# EAGLE board Avalon16 (EAGLE 5.12)
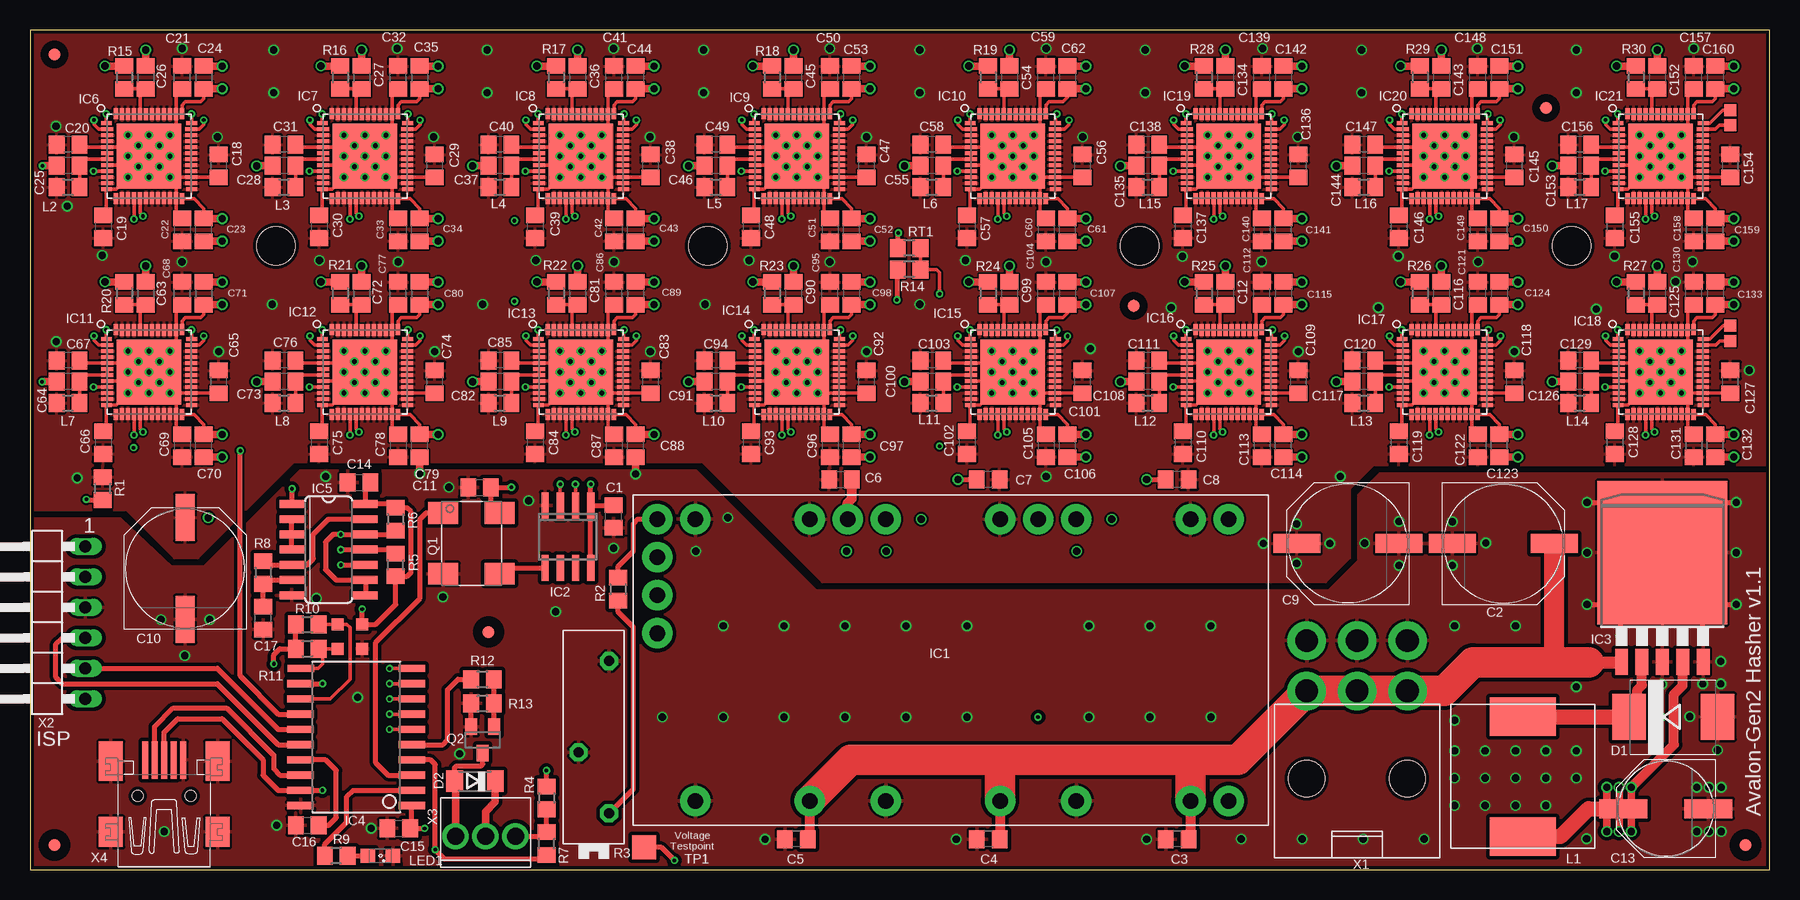
[diagram p5: board, top side]
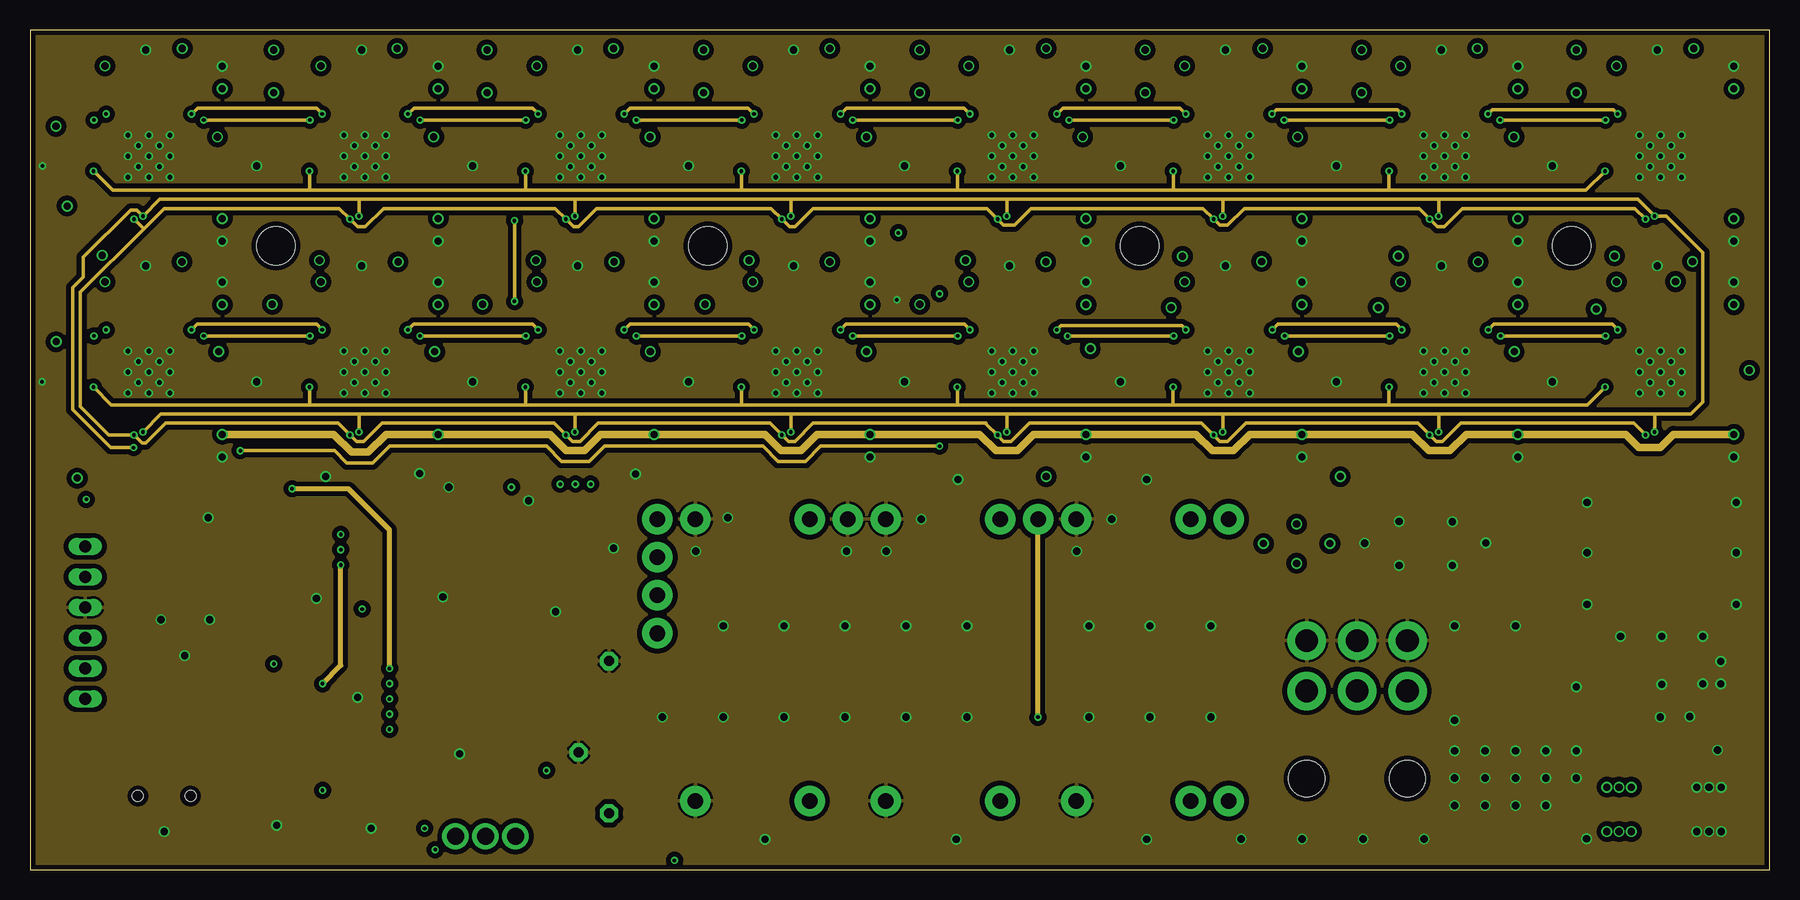
[diagram p6: board, inner layer Route2]
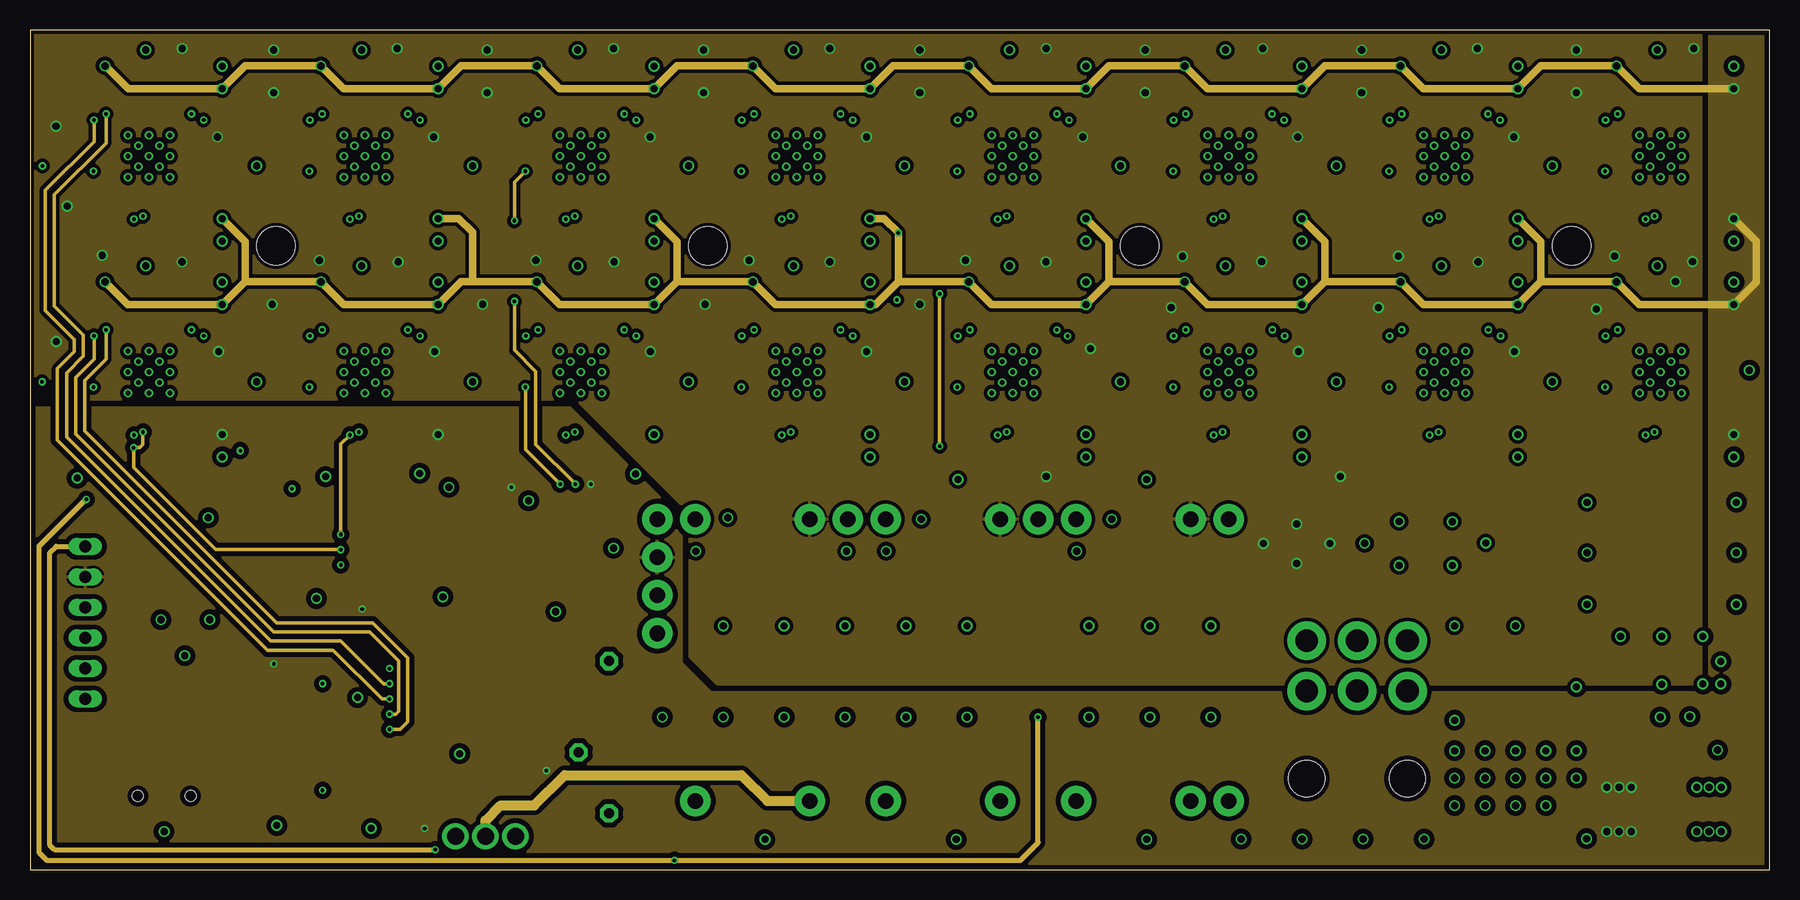
[diagram p7: board, inner layer Route15]
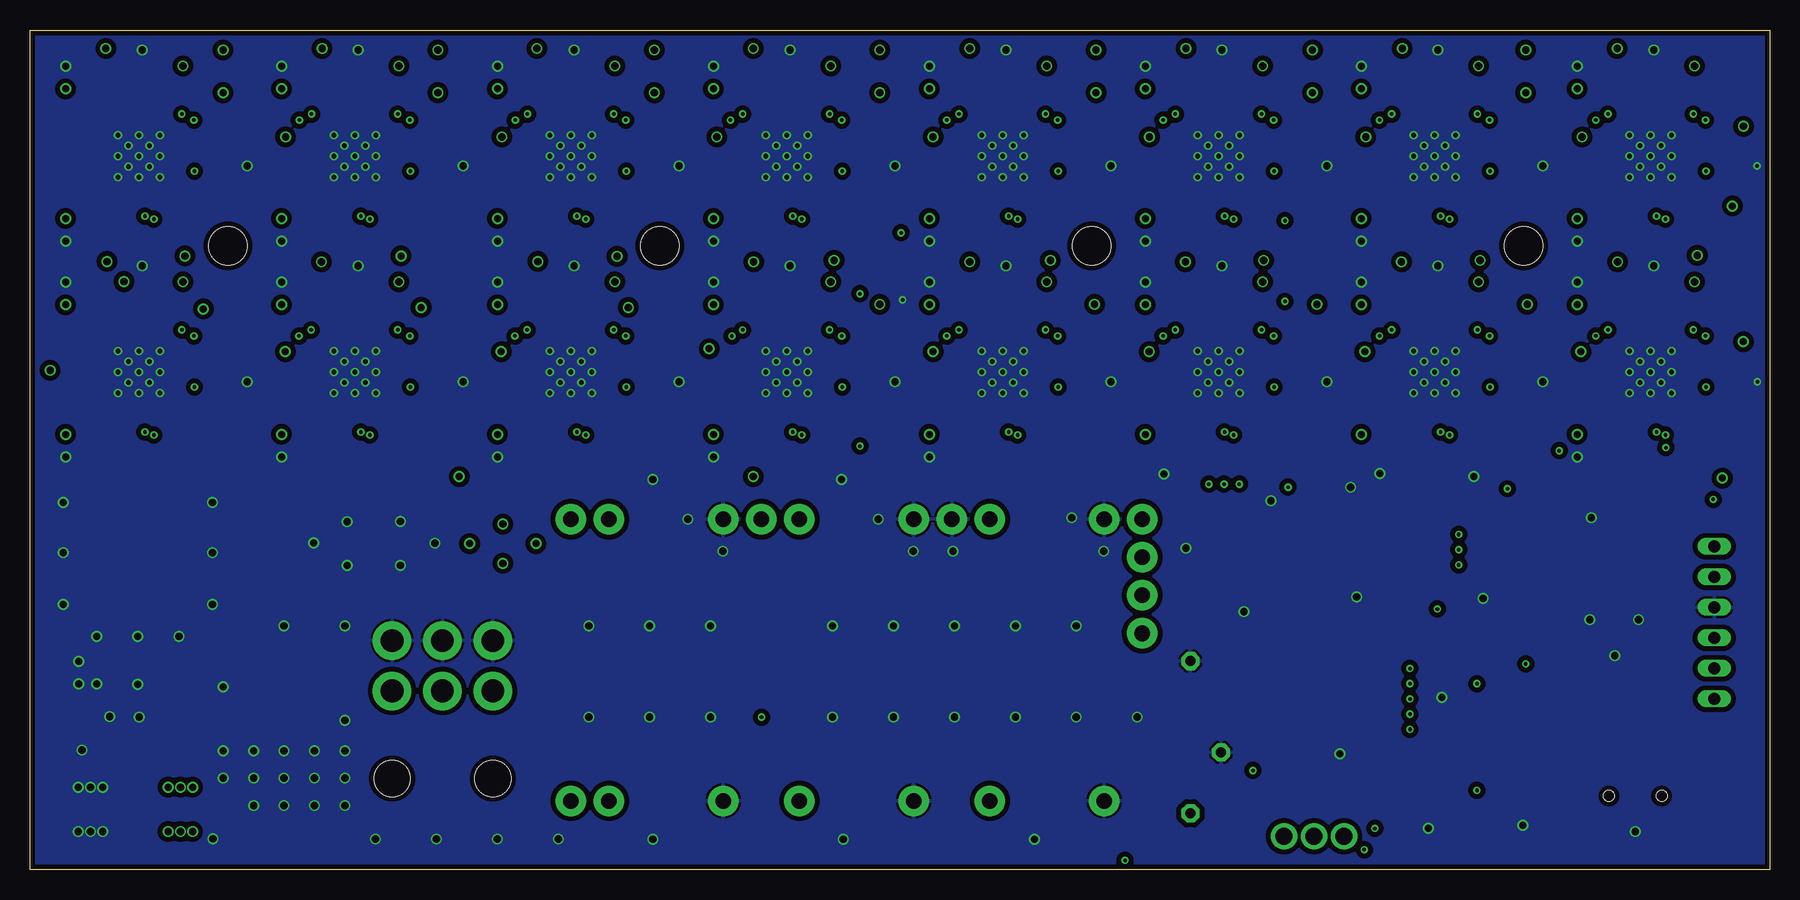
[diagram p8: board, bottom side, seen from below]

Size 145 x 70 mm. Coordinates in mm from the lower left corner, seen from the top.
Outline: 0,0 145,0 145,70 0,70 0,0
Copper layers (1+2*15+16): Top 0.035mm / dielectric 0.38mm / Route2 0.035mm / dielectric 0.71mm / Route15 0.035mm / dielectric 0.38mm / Bottom 0.035mm
Design rules "PCB-POOL Standard_ML4 *": minimum track width 0.15mm, minimum drill 0.3mm, track to track 0.15mm, track to pad 0.15mm, pad to pad 0.15mm, via to via 0.15mm, smd to smd 0.15mm, copper to edge 0.3mm, drill to drill 0.2mm, minimum pad ring 0.2mm, minimum via ring 0.15mm, stop-mask expansion 0.075mm, vias tented up to drill 0mil, thermal gap 0.2mm
Holes 3.2 mm at 20.5,52 56.5,52 128.5,52 92.5,52

## Footprints (pad centres in the part's own frame; a part is rotated, then mirrored left to right if it is on the bottom)
C0805 = smd 1.3 x 1.5: 1 -0.95,0; 2 0.95,0
PANASONIC_G = smd 3.9 x 1.6: + 4.25,0; - -4.25,0
PANASONIC_F = smd 4 x 1.6: + 3.55,0; - -3.55,0
SMC = smd 2.8 x 3.8: A 3.7,0; C -3.7,0
SOD80C = smd 1.4 x 1.8: A 1.7,0; C -1.7,0
FIDUCIAL = smd 1 x 1: 1 0,0
PTH12040WAH = drill 1.3 pad 2.54 round: 1 -20.213,-12.377; 2 -10.688,-12.377; 3 -4.338,-12.377; 4 5.187,-12.377; 5 11.537,-12.377; 6 21.062,-12.377; 7 24.237,-12.377; 8 24.237,11.118; 9 21.062,11.118; 10 11.537,11.118; 11 8.362,11.118; 12 5.187,11.118; 13 -4.338,11.118; 14 -7.513,11.118; 15 -10.688,11.118; 16 -20.213,11.118; 17 -23.388,11.118; 18 -23.388,7.943; 19 -23.388,4.768; 20 -23.388,1.593
SO8 = smd 0.6 x 2.2: 1 -1.905,-2.6; 2 -0.635,-2.6; 3 0.635,-2.6; 4 1.905,-2.6; 5 1.905,2.6; 6 0.635,2.6; 7 -0.635,2.6; 8 -1.905,2.6
TO263-5 = smd 1.067 x 2.159: 1 -3.404,-5.791; 2 -1.702,-5.791; 3 0,-5.791; 4 1.702,-5.791; 5 3.404,-5.791 | smd 10.8 x 11.938: 6 0,3.302
SOIC20 = smd 0.61 x 2.21: 1 -5.715,-4.636; 2 -4.445,-4.636; 3 -3.175,-4.636; 4 -1.905,-4.636; 5 -0.635,-4.636; 6 0.635,-4.636; 7 1.905,-4.636; 8 3.175,-4.636; 9 4.445,-4.636; 10 5.715,-4.636; 11 5.715,4.61; 12 4.445,4.636; 13 3.175,4.636; 14 1.905,4.636; 15 0.635,4.636; 16 -0.635,4.636; 17 -1.905,4.636; 18 -3.175,4.636; 19 -4.445,4.636; 20 -5.715,4.636
SO14 = smd 0.66 x 2.032: 1 -3.81,-3.073; 2 -2.54,-3.073; 3 -1.27,-3.073; 4 0,-3.073; 5 1.27,-3.073; 6 2.54,-3.073; 7 3.81,-3.073; 8 3.81,3.073; 9 2.54,3.073; 10 1.27,3.073; 11 0,3.073; 12 -1.27,3.073; 13 -2.54,3.073; 14 -3.81,3.073
QFN48 = smd 0.9 x 0.35: 1 -3.55,2.75; 12 -3.55,-2.75; 25 3.55,-2.75; 36 3.55,2.75 | smd 1 x 0.35: 2 -3.5,2.25; 3 -3.5,1.75; 4 -3.5,1.25; 5 -3.5,0.75; 6 -3.5,0.25; 7 -3.5,-0.25; 8 -3.5,-0.75; 9 -3.5,-1.25; 10 -3.5,-1.75; 11 -3.5,-2.25; 26 3.5,-2.25; 27 3.5,-1.75; 28 3.5,-1.25; 29 3.5,-0.75; 30 3.5,-0.25; 31 3.5,0.25; 32 3.5,0.75; 33 3.5,1.25; 34 3.5,1.75; 35 3.5,2.25 | smd 0.35 x 0.9: 13 -2.75,-3.55; 24 2.75,-3.55; 37 2.75,3.55; 48 -2.75,3.55 | smd 0.35 x 1: 14 -2.25,-3.5; 15 -1.75,-3.5; 16 -1.25,-3.5; 17 -0.75,-3.5; 18 -0.25,-3.5; 19 0.25,-3.5; 20 0.75,-3.5; 21 1.25,-3.5; 22 1.75,-3.5; 23 2.25,-3.5; 38 2.25,3.5; 39 1.75,3.5; 40 1.25,3.5; 41 0.75,3.5; 42 0.25,3.5; 43 -0.25,3.5; 44 -0.75,3.5; 45 -1.25,3.5; 46 -1.75,3.5; 47 -2.25,3.5 | smd 5.4 x 5.4: EXP 0,0
WUERTH-7447709101 = smd 5.5 x 3.2: 1 0,-5; 2 0,5
L0805 = smd 1.3 x 1.5: 1 -0.95,0; 2 0.95,0
SML0805 = smd 1.2 x 1.2: A 1.05,0; C -1.05,0
7W = smd 1.8 x 2.5: 1 -2.54,-2.35; 2 2.54,-2.35; 3 2.54,2.35; 4 -2.54,2.35
SOT23 = smd 1 x 1.4: 1 -0.95,-1.1; 2 0.95,-1.1; 3 0,1.1
R0805 = smd 1.3 x 1.5: 1 -0.95,0; 2 0.95,0
PT-SPIN = drill 0.813 pad 1.524 octagon: 1 -6.35,-1.27; 2 6.35,-1.27; 3 -1.27,1.27
0805 = smd 1.3 x 1.5: 1 -0.95,0; 2 0.95,0
TP20SQ = smd 2 x 2: TP 0,0
TP10SQ = smd 1 x 1: TP 0,0
MOLEX-45558-0003 = drill 1.9 pad 3.2 round: 1 4.2,7.3; 2 0,7.3; 3 -4.2,7.3; 4 4.2,11.5; 5 0,11.5; 6 -4.2,11.5 | hole 3: -4.2,0; 4.2,0
1X06/270 = drill 1.016 long: 1 -6.35,0; 2 -3.81,0; 3 -1.27,0; 4 1.27,0; 5 3.81,0; 6 6.35,0
MOLEX-22-04-1031 = drill 1.4 pad 2.2 round: 1 2.5,3.2; 2 0,3.2; 3 -2.5,3.2
32005-301 = smd 3.1 x 0.5: 1 3,1.6; 2 3,0.8; 3 3,0; 4 3,-0.8; 5 3,-1.6 | smd 2.5 x 2: M1 -3,-4.45; M2 -3,4.45 | smd 3.3 x 2: M3 2.9,4.45; M4 2.9,-4.45 | hole 0.9: 0,2.2; 0,-2.2

## Placement (x,y rotation side)
C1  100n  [C0805]  48.65,29.43 90 top
C2  680µ/16V/EEEFK1C681P  [PANASONIC_G]  122.81,27.18 0 top
C3  1µ  [C0805]  95.63,2.54 180 top
C4  1µ  [C0805]  79.88,2.54 180 top
C5  1µ  [C0805]  63.88,2.54 180 top
C6  10µ  [C0805]  67.56,32.51 0 top
C7  10µ  [C0805]  79.88,32.51 180 top
C8  10µ  [C0805]  95.63,32.51 180 top
C9  680µ/16V/EEEFK1C681P  [PANASONIC_G]  109.86,27.18 180 top
C10  680µ/16V/EEEFK1C681P  [PANASONIC_G]  12.94,25.1 90 top
C11  100n  [C0805]  37.48,31.86 0 top
C12  1µ  [C0805]  99.65,48.04 270 top
C13  1000µ/6.3V/EEEFP0J102AP  [PANASONIC_F]  136.36,5.07 180 top
C14  100n  [C0805]  27.43,32.26 0 top
C15  100n  [C0805]  30.73,3.43 0 top
C16  100n  [C0805]  23.11,3.68 0 top
C17  470p  [C0805]  19.43,20.95 90 top
C18  1µ  [C0805]  15.75,58.67 90 top
C19  1µ  [C0805]  6.1,53.59 270 top
C20  1µ  [C0805]  3.17,60.45 180 top
C21  1µ  [C0805]  12.7,66.04 90 top
C22  1µ  [C0805]  12.7,53.34 270 top
C23  1µ  [C0805]  14.48,53.34 90 top
C24  1µ  [C0805]  14.48,66.04 270 top
C25  1µ  [C0805]  3.17,58.67 180 top
C26  1µ  [C0805]  9.65,66.04 270 top
C27  1µ  [C0805]  27.65,66.04 270 top
C28  1µ  [C0805]  21.18,58.67 180 top
C29  1µ  [C0805]  33.75,58.67 90 top
C30  1µ  [C0805]  24.1,53.59 270 top
C31  1µ  [C0805]  21.18,60.45 180 top
C32  1µ  [C0805]  30.7,66.04 90 top
C33  1µ  [C0805]  30.7,53.34 270 top
C34  1µ  [C0805]  32.48,53.34 90 top
C35  1µ  [C0805]  32.48,66.04 270 top
C36  1µ  [C0805]  45.65,66.04 270 top
C37  1µ  [C0805]  39.17,58.67 180 top
C38  1µ  [C0805]  51.75,58.67 90 top
C39  1µ  [C0805]  42.1,53.59 270 top
C40  1µ  [C0805]  39.17,60.45 180 top
C41  1µ  [C0805]  48.7,66.04 90 top
C42  1µ  [C0805]  48.7,53.34 270 top
C43  1µ  [C0805]  50.48,53.34 90 top
C44  1µ  [C0805]  50.48,66.04 270 top
C45  1µ  [C0805]  63.65,66.04 270 top
C46  1µ  [C0805]  57.17,58.67 180 top
C47  1µ  [C0805]  69.75,58.67 90 top
C48  1µ  [C0805]  60.1,53.59 270 top
C49  1µ  [C0805]  57.17,60.45 180 top
C50  1µ  [C0805]  66.7,66.04 90 top
C51  1µ  [C0805]  66.7,53.34 270 top
C52  1µ  [C0805]  68.48,53.34 90 top
C53  1µ  [C0805]  68.48,66.04 270 top
C54  1µ  [C0805]  81.65,66.04 270 top
C55  1µ  [C0805]  75.17,58.67 180 top
C56  1µ  [C0805]  87.75,58.67 90 top
C57  1µ  [C0805]  78.1,53.59 270 top
C58  1µ  [C0805]  75.17,60.45 180 top
C59  1µ  [C0805]  84.7,66.04 90 top
C60  1µ  [C0805]  84.7,53.34 270 top
C61  1µ  [C0805]  86.48,53.34 90 top
C62  1µ  [C0805]  86.48,66.04 270 top
C63  1µ  [C0805]  9.65,48.04 270 top
C64  1µ  [C0805]  3.17,40.67 180 top
C65  1µ  [C0805]  15.75,40.67 90 top
C66  1µ  [C0805]  6.1,35.59 270 top
C67  1µ  [C0805]  3.17,42.45 180 top
C68  1µ  [C0805]  12.7,48.04 90 top
C69  1µ  [C0805]  12.7,35.34 270 top
C70  1µ  [C0805]  14.48,35.34 90 top
C71  1µ  [C0805]  14.48,48.04 270 top
C72  1µ  [C0805]  27.65,48.04 270 top
C73  1µ  [C0805]  21.18,40.67 180 top
C74  1µ  [C0805]  33.75,40.67 90 top
C75  1µ  [C0805]  24.1,35.59 270 top
C76  1µ  [C0805]  21.18,42.45 180 top
C77  1µ  [C0805]  30.7,48.04 90 top
C78  1µ  [C0805]  30.7,35.34 270 top
C79  1µ  [C0805]  32.48,35.34 90 top
C80  1µ  [C0805]  32.48,48.04 270 top
C81  1µ  [C0805]  45.65,48.04 270 top
C82  1µ  [C0805]  39.17,40.67 180 top
C83  1µ  [C0805]  51.75,40.67 90 top
C84  1µ  [C0805]  42.1,35.59 270 top
C85  1µ  [C0805]  39.17,42.45 180 top
C86  1µ  [C0805]  48.7,48.04 90 top
C87  1µ  [C0805]  48.7,35.34 270 top
C88  1µ  [C0805]  50.48,35.34 90 top
C89  1µ  [C0805]  50.48,48.04 270 top
C90  1µ  [C0805]  63.65,48.04 270 top
C91  1µ  [C0805]  57.17,40.67 180 top
C92  1µ  [C0805]  69.75,40.67 90 top
C93  1µ  [C0805]  60.1,35.59 270 top
C94  1µ  [C0805]  57.17,42.45 180 top
C95  1µ  [C0805]  66.7,48.04 90 top
C96  1µ  [C0805]  66.7,35.34 270 top
C97  1µ  [C0805]  68.48,35.34 90 top
C98  1µ  [C0805]  68.48,48.04 270 top
C99  1µ  [C0805]  81.65,48.04 270 top
C100  1µ  [C0805]  75.17,40.67 180 top
C101  1µ  [C0805]  87.75,40.67 90 top
C102  1µ  [C0805]  78.1,35.59 270 top
C103  1µ  [C0805]  75.17,42.45 180 top
C104  1µ  [C0805]  84.7,48.04 90 top
C105  1µ  [C0805]  84.7,35.34 270 top
C106  1µ  [C0805]  86.48,35.34 90 top
C107  1µ  [C0805]  86.48,48.04 270 top
C108  1µ  [C0805]  93.17,40.67 180 top
C109  1µ  [C0805]  105.75,40.67 90 top
C110  1µ  [C0805]  96.1,35.59 270 top
C111  1µ  [C0805]  93.17,42.45 180 top
C112  1µ  [C0805]  102.7,48.04 90 top
C113  1µ  [C0805]  102.7,35.34 270 top
C114  1µ  [C0805]  104.48,35.34 90 top
C115  1µ  [C0805]  104.48,48.04 270 top
C116  1µ  [C0805]  117.65,48.04 270 top
C117  1µ  [C0805]  111.17,40.67 180 top
C118  1µ  [C0805]  123.75,40.67 90 top
C119  1µ  [C0805]  114.1,35.59 270 top
C120  1µ  [C0805]  111.17,42.45 180 top
C121  1µ  [C0805]  120.7,48.04 90 top
C122  1µ  [C0805]  120.7,35.34 270 top
C123  1µ  [C0805]  122.48,35.34 90 top
C124  1µ  [C0805]  122.48,48.04 270 top
C125  1µ  [C0805]  135.65,48.04 270 top
C126  1µ  [C0805]  129.18,40.67 180 top
C127  1µ  [C0805]  141.75,40.67 90 top
C128  1µ  [C0805]  132.1,35.59 270 top
C129  1µ  [C0805]  129.18,42.45 180 top
C130  1µ  [C0805]  138.7,48.04 90 top
C131  1µ  [C0805]  138.7,35.34 270 top
C132  1µ  [C0805]  140.48,35.34 90 top
C133  1µ  [C0805]  140.48,48.04 270 top
C134  1µ  [C0805]  99.65,66.04 270 top
C135  1µ  [C0805]  93.17,58.67 180 top
C136  1µ  [C0805]  105.75,58.67 90 top
C137  1µ  [C0805]  96.1,53.59 270 top
C138  1µ  [C0805]  93.17,60.45 180 top
C139  1µ  [C0805]  102.7,66.04 90 top
C140  1µ  [C0805]  102.7,53.34 270 top
C141  1µ  [C0805]  104.48,53.34 90 top
C142  1µ  [C0805]  104.48,66.04 270 top
C143  1µ  [C0805]  117.65,66.04 270 top
C144  1µ  [C0805]  111.17,58.67 180 top
C145  1µ  [C0805]  123.75,58.67 90 top
C146  1µ  [C0805]  114.1,53.59 270 top
C147  1µ  [C0805]  111.17,60.45 180 top
C148  1µ  [C0805]  120.7,66.04 90 top
C149  1µ  [C0805]  120.7,53.34 270 top
C150  1µ  [C0805]  122.48,53.34 90 top
C151  1µ  [C0805]  122.48,66.04 270 top
C152  1µ  [C0805]  135.65,66.04 270 top
C153  1µ  [C0805]  129.18,58.67 180 top
C154  1µ  [C0805]  141.75,58.67 90 top
C155  1µ  [C0805]  132.1,53.59 270 top
C156  1µ  [C0805]  129.18,60.45 180 top
C157  1µ  [C0805]  138.7,66.04 90 top
C158  1µ  [C0805]  138.7,53.34 270 top
C159  1µ  [C0805]  140.48,53.34 90 top
C160  1µ  [C0805]  140.48,66.04 270 top
D1  MBRS340T3G  [SMC]  136.98,12.73 0 top
D2  4448  [SOD80C]  37.08,7.37 180 top
FID1  1mm  [FIDUCIAL]  2.03,2.03 0 top
FID2  1mm  [FIDUCIAL]  143,2.03 0 top
FID3  1mm  [FIDUCIAL]  126.36,63.5 0 top
FID4  1mm  [FIDUCIAL]  2.03,67.94 270 top
FID5  1mm  [FIDUCIAL]  92,47 0 top
FID6  1mm  [FIDUCIAL]  38.23,19.81 0 top
IC1  PTH12040WAH  [PTH12040WAH]  75.67,18.1 0 top
IC2  NB3L553DG  [SO8]  44.84,27.75 180 top
IC3  LM2576S-3.3  [TO263-5]  136.06,23.12 0 top
IC4  PIC16LF1459  [SOIC20]  27.18,11.05 90 top
IC5  74HC02D  [SO14]  24.89,26.67 270 top
IC6  A3255Q48  [QFN48]  9.92,59.48 0 top
IC7  A3255Q48  [QFN48]  27.92,59.48 0 top
IC8  A3255Q48  [QFN48]  45.92,59.48 0 top
IC9  A3255Q48  [QFN48]  63.92,59.48 0 top
IC10  A3255Q48  [QFN48]  81.92,59.48 0 top
IC11  A3255Q48  [QFN48]  9.92,41.48 0 top
IC12  A3255Q48  [QFN48]  27.92,41.48 0 top
IC13  A3255Q48  [QFN48]  45.92,41.48 0 top
IC14  A3255Q48  [QFN48]  63.92,41.48 0 top
IC15  A3255Q48  [QFN48]  81.92,41.48 0 top
IC16  A3255Q48  [QFN48]  99.92,41.48 0 top
IC17  A3255Q48  [QFN48]  117.92,41.48 0 top
IC18  A3255Q48  [QFN48]  135.92,41.48 0 top
IC19  A3255Q48  [QFN48]  99.92,59.48 0 top
IC20  A3255Q48  [QFN48]  117.92,59.48 0 top
IC21  A3255Q48  [QFN48]  135.92,59.48 0 top
L1  100µ / Würth 7447709101  [WUERTH-7447709101]  124.43,7.76 180 top
L2  100µ  [L0805]  3.17,56.9 0 top
L3  100µ  [L0805]  21.18,56.9 0 top
L4  100µ  [L0805]  39.17,56.9 0 top
L5  100µ  [L0805]  57.17,56.9 0 top
L6  100µ  [L0805]  75.17,56.9 0 top
L7  100µ  [L0805]  3.17,38.9 0 top
L8  100µ  [L0805]  21.18,38.9 0 top
L9  100µ  [L0805]  39.17,38.9 0 top
L10  100µ  [L0805]  57.17,38.9 0 top
L11  100µ  [L0805]  75.17,38.9 0 top
L12  100µ  [L0805]  93.17,38.9 0 top
L13  100µ  [L0805]  111.17,38.9 0 top
L14  100µ  [L0805]  129.18,38.9 0 top
L15  100µ  [L0805]  93.17,56.9 0 top
L16  100µ  [L0805]  111.17,56.9 0 top
L17  100µ  [L0805]  129.18,56.9 0 top
LED1  green  [SML0805]  29.21,1.14 180 top
Q1  7W-25-000MBB-T  [7W]  36.8,27.19 270 top
Q2  IRFML8244TRPBF  [SOT23]  37.73,10.81 180 top
R1  0R  [R0805]  6.05,31.77 90 top
R2  15k  [R0805]  49.02,23.37 270 top
R3  100k  [PT-SPIN]  46.99,11.04 90 top
R4  10k  [R0805]  43.05,5.97 270 top
R5  390  [R0805]  30.48,25.4 90 top
R6  390  [R0805]  30.48,29.21 270 top
R7  100  [R0805]  43.05,2.16 90 top
R8  100  [R0805]  19.43,24.77 270 top
R9  100  [R0805]  25.53,1.14 180 top
R10  10k  [R0805]  23.11,20.45 0 top
R11  10k  [R0805]  23.11,18.41 0 top
R12  100  [R0805]  37.72,15.88 0 top
R13  10k  [R0805]  37.72,13.84 180 top
R14  1k  [R0805]  73.28,50.04 180 top
R15  100k  [R0805]  7.87,66.04 270 top
R16  100k  [R0805]  25.87,66.04 270 top
R17  100k  [R0805]  43.87,66.04 270 top
R18  100k  [R0805]  61.87,66.04 270 top
R19  100k  [R0805]  79.87,66.04 270 top
R20  100k  [R0805]  7.87,48.04 270 top
R21  100k  [R0805]  25.87,48.04 270 top
R22  100k  [R0805]  43.87,48.04 270 top
R23  100k  [R0805]  61.87,48.04 270 top
R24  100k  [R0805]  79.87,48.04 270 top
R25  100k  [R0805]  97.87,48.04 270 top
R26  100k  [R0805]  115.87,48.04 270 top
R27  100k  [R0805]  133.87,48.04 270 top
R28  100k  [R0805]  97.87,66.04 270 top
R29  100k  [R0805]  115.87,66.04 270 top
R30  100k  [R0805]  133.87,66.04 270 top
RT1  2k2  [0805]  73.28,51.82 180 top
TP1  TPSQTP20SQ  [TP20SQ]  51.21,1.84 0 top
TP2  TPSQTP10SQ  [TP10SQ]  141.73,63.32 0 top
TP3  TPSQTP10SQ  [TP10SQ]  141.73,62.05 0 top
TP4  TPSQTP10SQ  [TP10SQ]  141.73,45.34 0 top
TP5  TPSQTP10SQ  [TP10SQ]  141.73,44.07 0 top
TP6  TPSQTP10SQ  [TP10SQ]  27.69,20.45 90 top
TP7  TPSQTP10SQ  [TP10SQ]  25.65,18.41 90 top
TP8  TPSQTP10SQ  [TP10SQ]  25.65,20.45 90 top
TP9  TPSQTP10SQ  [TP10SQ]  27.69,18.41 90 top
X1  Molex 45558-0003  [MOLEX-45558-0003]  110.62,7.59 0 top
X2  ISP  [1X06/270]  4.6,20.59 270 top
X3  Molex 22-04-1031  [MOLEX-22-04-1031]  37.97,5.97 180 top
X4  Würth 65100516121 / TE 1734035-2  [32005-301]  11.18,6.13 90 top

## Tracks (layer width: path | path; a pad name or v marks a point on that pad's centre or on a via)
!MCLR  (via drill 0.3)
  Top 0.406: IC4.4 33.4,9.14 33.78,8.76 v33.78,1.65 34.54,0.89 42.73,0.89 R7.1
  Route15 0.406: X2.1 2.17,26.94 1.65,26.42 1.65,2.03 2.03,1.65 v33.78,1.65
!RESET1
  Top 0.305: R15.2 C26.2 9.17,64.61 IC6.44
!RESET2
  Top 0.305: R16.2 C27.2 27.17,64.61 IC7.44
!RESET3
  Top 0.305: R17.2 C36.2 45.17,64.61 IC8.44
!RESET4
  Top 0.305: R18.2 C45.2 63.17,64.61 IC9.44
!RESET5
  Top 0.305: R19.2 C54.2 81.17,64.61 IC10.44
!RESET6
  Top 0.305: R20.2 C63.2 9.17,46.61 IC11.44
!RESET7
  Top 0.305: R21.2 C72.2 27.17,46.61 IC12.44
!RESET8
  Top 0.305: R22.2 C81.2 45.17,46.61 IC13.44
!RESET9
  Top 0.305: R23.2 C90.2 63.17,46.61 IC14.44
!RESET10
  Top 0.305: R24.2 C99.2 81.17,46.61 IC15.44
!RESET11
  Top 0.305: R25.2 C12.2 99.17,46.61 IC16.44
!RESET12
  Top 0.305: R26.2 C116.2 117.17,46.61 IC17.44
!RESET13
  Top 0.305: R27.2 C125.2 135.17,46.61 IC18.44
!RESET14
  Top 0.305: R28.2 C134.2 99.17,64.61 IC19.44
!RESET15
  Top 0.305: R29.2 C143.2 117.17,64.61 IC20.44
!RESET16
  Top 0.305: R30.2 C152.2 135.17,64.61 IC21.44
+3V3  (via drill 0.3, 0.6)
  Top 0.305: IC6.37 12.67,63.72 12.95,64.01 14.22,64.01 14.48,64.26 C24.2 | IC6.24 13.67,55.93 14.48,55.12 C23.2 | IC7.37 30.67,63.72 30.95,64.01 32.22,64.01 32.48,64.26 C35.2 | IC7.24 31.67,55.93 32.48,55.12 C34.2 | IC8.37 48.67,63.72 48.95,64.01 50.22,64.01 50.48,64.26 C44.2 | IC8.24 49.67,55.93 50.48,55.12 C43.2 | IC9.37 66.67,63.72 66.95,64.01 68.22,64.01 68.48,64.26 C53.2 | IC9.24 67.67,55.93 68.48,55.12 C52.2 | IC10.37 84.67,63.72 84.95,64.01 86.1,64.01 86.48,64.39 C62.2 | IC10.24 85.67,55.93 86.48,55.12 C61.2 | IC11.37 12.67,45.72 12.95,46.01 14.22,46.01 14.48,46.26 C71.2 | IC11.24 13.67,37.93 14.48,37.12 C70.2 | IC12.37 30.67,45.72 30.95,46.01 32.22,46.01 32.48,46.26 C80.2 | IC12.24 31.67,37.93 32.48,37.12 C79.2 | IC13.37 48.67,45.72 48.95,46.01 50.22,46.01 50.48,46.26 C89.2 | IC13.24 49.67,37.93 50.48,37.12 C88.2 | IC14.37 66.67,45.72 66.95,46.01 68.22,46.01 68.48,46.26 C98.2 | IC14.24 67.67,37.93 68.48,37.12 C97.2 | IC15.37 84.67,45.72 84.95,46.01 86.1,46.01 86.48,46.39 C107.2 | IC15.24 85.67,37.93 86.48,37.12 C106.2 | IC16.37 102.67,45.72 102.95,46.01 104.22,46.01 104.48,46.26 C115.2 | IC16.24 103.67,37.93 104.48,37.12 C114.2 | IC17.37 120.67,45.72 120.95,46.01 122.22,46.01 122.48,46.26 C124.2 | IC17.24 121.67,37.93 122.48,37.12 C123.2 | IC18.37 138.67,45.72 138.95,46.01 140.22,46.01 140.48,46.26 C133.2 | IC18.24 139.67,37.93 140.48,37.12 C132.2 | IC19.37 102.67,63.72 102.95,64.01 104.22,64.01 104.48,64.26 C142.2 | IC19.24 103.67,55.93 104.48,55.12 C141.2 | IC20.37 120.67,63.72 120.95,64.01 122.22,64.01 122.48,64.26 C151.2 | IC20.24 121.67,55.93 122.48,55.12 C150.2
  Top 0.305: IC21.37 138.67,63.72 138.95,64.01 140.22,64.01 140.48,64.26 C160.2 | IC21.24 139.67,55.93 140.48,55.12 C159.2
  Top 0.406: C14.2 27.96,31.84 IC5.14 30.16,30.48 R6.1 31.43,30.16 31.75,29.84 31.75,24.77 31.43,24.45 R5.1 30.48,22.1 28.83,20.45 TP6.TP v27.69,21.72 | IC2.8 IC2.1 | Q1.4 38.43,30.46 C11.2 40.12,31.86 v40.13,31.88 | IC2.1 48.61,30.35 C1.2 | IC2.1 v46.74,32.12 v46.74,32.13 | R4.1 v43.05,8.26 | v20.32,17.14 20.32,17.91 20.83,18.41 R11.1 R10.1 | 72.77,51.82 RT1.2 72.33,53.02 v72.39,53.09 | IC4.1 31.81,3.56 C15.2 v32.89,3.43
  Top 0.61: R15.1 6.26,66.99 v6.25,67 | C24.2 16.02,65.09 v16.03,65.1 | C23.2 16.02,54.29 v16.03,54.28 | R16.1 24.26,66.99 v24.25,67 | C35.2 34.02,65.09 v34.03,65.1 | C34.2 34.02,54.29 v34.03,54.28 | R17.1 42.26,66.99 v42.25,67 | C44.2 52.02,65.09 v52.03,65.1 | C43.2 52.02,54.29 v52.03,54.28 | R18.1 60.26,66.99 v60.25,67 | C53.2 70.02,65.09 v70.03,65.1 | C52.2 70.02,54.29 v70.03,54.28 | R19.1 78.26,66.99 v78.25,67 | C62.2 88.02,65.09 v88.03,65.1 | C61.2 88.02,54.29 v88.03,54.28 | R20.1 6.26,48.99 v6.25,49.01 | C71.2 16.02,47.09 v16.03,47.1 | C70.2 16.02,36.29 v16.03,36.28 | R21.1 24.26,48.99 v24.25,49.01 | C80.2 34.02,47.09 v34.03,47.1 | C79.2 34.02,36.29 v34.03,36.28 | R22.1 42.26,48.99 v42.25,49.01 | C89.2 52.02,47.09 v52.03,47.1 | C88.2 52.02,36.29 v52.03,36.28 | R23.1 60.26,48.99 v60.25,49.01 | C97.2 70.02,36.29 v70.03,36.28 | R24.1 78.26,48.99 v78.25,49.01 | C107.2 88.02,47.09 v88.03,47.1 | C106.2 88.02,36.29 v88.03,36.28 | v133.48,3.17 133.48,5.08 v133.48,6.86 | v131.44,3.17 v131.44,6.86 | v132.46,3.17 132.46,5.08 v132.46,6.86 | R25.1 96.26,48.99 v96.25,49.01 | C115.2 106.02,47.09 v106.03,47.1 | C114.2 106.02,36.29 v106.03,36.28 | R26.1 114.26,48.99 v114.25,49.01 | C124.2 124.02,47.09 v124.03,47.1 | C123.2 124.02,36.29 v124.03,36.28 | R27.1 132.26,48.99 v132.25,49.01 | C133.2 142.02,47.09 v142.03,47.1 | C132.2 142.02,36.29 v142.03,36.28 | R28.1 96.26,66.99 v96.25,67 | C142.2 106.02,65.09 v106.03,65.1 | C141.2 106.02,54.29 v106.03,54.28 | R29.1 114.26,66.99 v114.25,67 | C151.2 124.02,65.09 v124.03,65.1 | C150.2 124.02,54.29 v124.03,54.28 | R30.1 132.26,66.99 v132.25,67 | C160.2 142.02,65.09 v142.03,65.1 | C159.2 142.02,54.29 v142.03,54.28
  Top 0.61: C98.2 70.02,47.09 v70.03,47.1
  Top 0.813: 133.48,5.08 C13.+ | IC3.4 137.77,15.34 137.03,14.61 137.03,10.41 v133.48,6.86
  Top 1.27: 132.46,5.08 132.45,5.07 129.91,5.07 127.6,2.76 L1.2
  Route2 0.61: v16.03,36.28 25.32,36.28 26.8,34.8 28.19,34.8 29.68,36.28 v34.03,36.28 43.35,36.28 44.7,34.92 46.23,34.92 47.58,36.28 v52.03,36.28 61.26,36.28 62.61,34.92 64.26,34.92 65.62,36.28 v70.03,36.28 79.16,36.28 80.52,34.92 82.3,34.92 83.65,36.28 v88.03,36.28 97.2,36.28 98.55,34.92 100.33,34.92 101.69,36.28 v106.03,36.28 115.23,36.28 116.59,34.92 118.36,34.92 119.72,36.28 v124.03,36.28 133.01,36.28 134.11,35.18 135.89,35.18 136.99,36.28 v142.03,36.28
  Route15 0.406: 6.22,67.06 6.22,67.03 v6.25,67
  Route15 0.61: 53.93,49.01 v52.03,47.1 44.15,47.1 v42.25,49.01 36.88,49.01 | v52.03,54.28 53.93,52.38 53.93,49.01 | v16.03,54.28 17.93,52.38 17.93,49.01 | 17.93,49.01 v24.25,49.01 26.15,47.1 v34.03,47.1 35.93,49.01 36.88,49.01 | 53.93,49.01 v60.25,49.01 62.15,47.1 v70.03,47.1 v70.04,47.09 70.47,47.09 72.39,49.01 | 72.39,49.01 v78.25,49.01 80.15,47.1 v88.03,47.1 89.93,49.01 | v6.25,49.01 8.15,47.1 v16.03,47.1 17.93,49.01 | v34.03,54.28 35.74,54.28 36.88,53.14 36.88,49.01 | 6.22,67.06 8.18,65.1 v16.03,65.1 17.93,67 v24.25,67 26.15,65.1 v34.03,65.1 35.93,67 v42.25,67 44.15,65.1 v52.03,65.1 53.93,67 v60.25,67 62.15,65.1 v70.03,65.1 71.93,67 v78.25,67 80.15,65.1 v88.03,65.1 89.93,67 v96.25,67 98.15,65.1 v106.03,65.1 107.93,67 v114.25,67 116.15,65.1 v124.03,65.1 125.93,67 v132.25,67 134.15,65.1 v142.03,65.1 | 89.93,49.01 v96.25,49.01 98.15,47.1 v106.03,47.1 107.93,49.01 | v88.03,54.28 89.93,52.38 89.93,49.01 | v106.03,54.28 107.93,52.38 107.93,49.01 | 125.93,49.01 v132.25,49.01 134.15,47.1 v142.03,47.1 143.89,48.96 143.89,52.42 v142.03,54.28 | 125.93,49.01 v124.03,47.1 116.15,47.1 v114.25,49.01 107.93,49.01 | v124.03,54.28 125.93,52.38 125.93,49.01 | v70.03,54.28 71.2,54.28 v72.39,53.09 72.39,49.01
  pour Route15 (isolate 0.406): 145,0 145,70 140,70 140,14.75 56.75,14.75 54.25,17.25 54.25,29.25 45,38.5 0,38.5 0,0
+12V
  Top 0.61: X3.2 37.97,4.83 38.78,5.64 D2.C
  Top 0.813: IC1.2 64.99,2.7 C5.1 | IC1.4 80.86,2.57 C4.1 | IC1.6 96.74,2.7 C3.1
  Top 1.016: IC3.1 132.6,17.27 129.92,17.27 127.13,17.27 127.06,17.34
  Top 1.676: 127.06,17.34 C2.+
  Top 2.54: IC1.2 68.41,9.14 80.9,9.14 | 80.9,9.14 96.65,9.14 | 96.65,9.14 100.67,9.14 X1.3 X1.2 X1.1 117.89,14.89 120.27,17.27 129.92,17.27 | IC1.6 96.74,9.05 96.65,9.14 | IC1.4 80.86,9.11 80.9,9.14
  Route15 0.813: IC1.2 61.46,5.72 59.31,7.87 44.58,7.87 42.04,5.33 39.24,5.33 37.97,4.06 X3.2
CLK1  (via drill 0.3)
  Top 0.305: IC6.9 v5.29,58.23 | v23.29,58.23 IC7.9 | v41.29,58.23 IC8.9 | v59.29,58.23 IC9.9 | v77.29,58.23 IC10.9 | v95.29,58.23 IC19.9 | v131.29,58.23 IC21.9 | v113.29,58.23 IC20.9 | IC2.2 v45.47,32.12 v45.47,32.13
  Route2 0.305: 41.3,56.64 59.31,56.64 | 59.31,56.64 77.29,56.64 | v77.29,58.23 77.29,56.64 | v59.29,58.23 59.29,56.66 59.31,56.64 | v41.29,58.23 41.29,56.65 41.3,56.64 | 23.29,56.64 6.88,56.64 v5.29,58.23 | 23.29,56.64 41.3,56.64 | v23.29,58.23 23.29,56.64 | v131.29,58.23 129.71,56.64 113.28,56.64 | 95.25,56.64 113.28,56.64 | v113.29,58.23 v113.28,58.22 113.28,56.64 | v95.29,58.23 95.29,56.69 95.25,56.64 | 77.29,56.64 95.25,56.64 | v40.39,54.1 v40.39,47.37
  Route15 0.305: v45.47,32.13 42.16,35.43 42.16,41.53 40.39,43.31 v40.39,47.37 | v40.39,54.1 40.39,57.32 v41.29,58.23
CLK2  (via drill 0.3)
  Top 0.305: IC11.9 v5.29,40.23 | v23.29,40.23 IC12.9 | v41.29,40.23 IC13.9 | v59.29,40.23 IC14.9 | v77.29,40.23 IC15.9 | v95.29,40.23 IC16.9 | v113.29,40.23 IC17.9 | v131.29,40.23 IC18.9 | IC2.3 v44.2,32.12 v44.2,32.13
  Route2 0.305: 41.3,38.73 59.33,38.73 | 59.33,38.73 77.32,38.73 | v77.29,40.23 77.29,38.76 77.32,38.73 | v59.29,40.23 59.29,38.78 59.33,38.73 | v41.29,40.23 41.29,38.74 41.3,38.73 | 23.29,38.73 41.3,38.73 | v23.29,40.23 23.29,38.74 23.29,38.73 | 23.29,38.73 6.79,38.73 v5.29,40.23 | v131.29,40.23 129.8,38.73 113.28,38.73 | 95.25,38.73 113.28,38.73 | v113.29,40.23 v113.28,40.22 113.28,38.73 | v95.29,40.23 95.25,40.19 95.25,38.73 | 77.32,38.73 95.25,38.73
  Route15 0.305: v44.2,32.13 41.29,35.03 v41.29,40.23
CONFIG1_1_2_N  (via drill 0.3)
  Top 0.305: IC7.2 23.71,61.73 23.33,62.1 v23.33,62.48 | IC6.35 14.1,61.73 14.48,62.1 v14.48,62.48
  Route2 0.305: v14.48,62.48 v23.33,62.48
CONFIG1_1_2_P  (via drill 0.3)
  Top 0.305: IC7.1 24.37,62.97 v24.35,62.99 | IC6.36 v13.47,62.98 v13.46,62.99
  Route2 0.305: v13.46,62.99 13.97,63.5 23.88,63.5 24.35,63.03 v24.35,62.99
CONFIG1_2_3_N  (via drill 0.3)
  Top 0.305: IC8.2 41.71,61.73 41.33,62.1 v41.33,62.48 | IC7.35 32.14,61.73 32.51,62.1 v32.51,62.48
  Route2 0.305: v32.51,62.48 v41.33,62.48
CONFIG1_2_3_P  (via drill 0.3)
  Top 0.305: IC8.1 42.37,62.97 v42.35,62.99 | IC7.36 31.47,62.97 v31.5,62.99
  Route2 0.305: v31.5,62.99 32,63.5 41.91,63.5 42.35,63.06 v42.35,62.99
CONFIG1_3_4_N  (via drill 0.3)
  Top 0.305: IC9.2 59.71,61.73 59.33,62.1 v59.33,62.48 | IC8.35 50.17,61.73 50.55,62.1 v50.55,62.48
  Route2 0.305: v50.55,62.48 v59.33,62.48
CONFIG1_3_4_P  (via drill 0.3)
  Top 0.305: IC9.1 60.37,62.97 v60.35,62.99 | IC8.36 49.47,62.93 v49.53,62.99
  Route2 0.305: v49.53,62.99 50.04,63.5 59.84,63.5 v60.35,62.99
CONFIG1_4_5_N  (via drill 0.3)
  Top 0.305: IC10.2 77.71,61.73 77.33,62.1 v77.33,62.48 | IC9.35 68.2,61.73 68.58,62.1 v68.58,62.48
  Route2 0.305: v68.58,62.48 v77.33,62.48
CONFIG1_4_5_P  (via drill 0.3)
  Top 0.305: IC10.1 78.37,62.97 v78.35,62.99 | IC9.36 67.47,62.9 v67.56,62.99
  Route2 0.305: v67.56,62.99 68.07,63.5 77.84,63.5 v78.35,62.99
CONFIG1_5_6_N  (via drill 0.3)
  Top 0.305: IC19.2 95.71,61.73 95.33,62.1 v95.33,62.48 | IC10.35 86.24,61.73 86.61,62.1 v86.61,62.48
  Route2 0.305: v86.61,62.48 v95.33,62.48
CONFIG1_5_6_P  (via drill 0.3)
  Top 0.305: IC19.1 96.37,62.97 v96.35,62.99 | IC10.36 85.47,62.86 v85.6,62.99
  Route2 0.305: v85.6,62.99 86.11,63.5 95.84,63.5 v96.35,62.99
CONFIG1_6_7_N  (via drill 0.3)
  Top 0.305: IC19.35 104.17,61.73 104.55,62.1 v104.55,62.48 | IC20.2 113.71,61.73 113.33,62.1 v113.33,62.48
  Route2 0.305: v104.55,62.48 v113.33,62.48
CONFIG1_6_7_P  (via drill 0.3)
  Top 0.305: IC19.36 103.47,62.93 v103.53,62.99 | IC20.1 114.37,62.97 v114.35,62.99
  Route2 0.305: v103.53,62.99 103.91,63.37 113.97,63.37 v114.35,62.99
CONFIG1_7_8_N  (via drill 0.3)
  Top 0.305: IC20.35 122.17,61.73 122.55,62.1 v122.55,62.48 | IC21.2 131.71,61.73 131.33,62.1 v131.33,62.48
  Route2 0.305: v122.55,62.48 v131.33,62.48
CONFIG1_7_8_P  (via drill 0.3)
  Top 0.305: IC20.36 121.47,62.93 v121.53,62.99 | IC21.1 132.37,62.97 v132.35,62.99
  Route2 0.305: v121.53,62.99 121.91,63.37 131.97,63.37 v132.35,62.99
CONFIG1_8_N
  Top 0.305: IC21.35 140.49,61.73 140.82,62.05 TP3.TP
CONFIG1_8_P
  Top 0.305: IC21.36 140.03,62.23 141.12,63.32 TP2.TP
CONFIG1_N  (via drill 0.3)
  Top 0.305: IC6.2 5.71,61.73 5.33,62.1 v5.33,62.48 | v29.97,14.22 IC4.8
  Route15 0.305: v29.97,14.22 29.34,14.22 25.27,18.29 19.81,18.29 2.29,35.81 2.29,41.78 3.68,43.18 3.68,44.2 1.27,46.61 1.27,56.64 5.33,60.71 v5.33,62.48
CONFIG1_P  (via drill 0.3)
  Top 0.305: v29.97,15.49 IC4.9 | IC6.1 6.37,62.97 v6.35,62.99
  Route15 0.305: v29.97,15.49 29.46,15.49 25.91,19.05 20.07,19.05 3.05,36.07 3.05,41.4 4.45,42.8 4.45,44.58 2.03,46.99 2.03,56.26 6.35,60.58 v6.35,62.99
CONFIG2_1_2_N  (via drill 0.3)
  Top 0.305: IC12.2 23.71,43.73 23.33,44.1 v23.33,44.48 | IC11.35 14.1,43.73 14.48,44.1 v14.48,44.48
  Route2 0.305: v14.48,44.48 v23.33,44.48
CONFIG2_1_2_P  (via drill 0.3)
  Top 0.305: IC12.1 24.37,44.97 v24.35,44.99 | IC11.36 v13.47,44.98 v13.46,44.99
  Route2 0.305: v13.46,44.99 13.94,45.47 23.88,45.47 v24.35,44.99
CONFIG2_2_3_N  (via drill 0.3)
  Top 0.305: IC13.2 41.71,43.73 41.33,44.1 v41.33,44.48 | IC12.35 32.14,43.73 32.51,44.1 v32.51,44.48
  Route2 0.305: v32.51,44.48 v41.33,44.48
CONFIG2_2_3_P  (via drill 0.3)
  Top 0.305: IC13.1 42.37,44.97 v42.35,44.99 | IC12.36 31.47,44.97 v31.5,44.99
  Route2 0.305: v31.5,44.99 31.97,45.47 41.88,45.47 v42.35,44.99
CONFIG2_3_4_N  (via drill 0.3)
  Top 0.305: IC14.2 59.71,43.73 59.33,44.1 v59.33,44.48 | IC13.35 50.17,43.73 50.55,44.1 v50.55,44.48
  Route2 0.305: v50.55,44.48 v59.33,44.48
CONFIG2_3_4_P  (via drill 0.3)
  Top 0.305: IC14.1 60.37,44.97 v60.35,44.99 | IC13.36 49.47,44.93 v49.53,44.99
  Route2 0.305: v49.53,44.99 50,45.47 59.88,45.47 v60.35,44.99
CONFIG2_4_5_N  (via drill 0.3)
  Top 0.305: IC15.2 77.71,43.73 77.33,44.1 v77.33,44.48 | IC14.35 68.2,43.73 68.58,44.1 v68.58,44.48
  Route2 0.305: v68.58,44.48 v77.33,44.48
CONFIG2_4_5_P  (via drill 0.3)
  Top 0.305: IC15.1 78.37,44.97 v78.35,44.99 | IC14.36 67.47,44.9 v67.56,44.99
  Route2 0.305: v67.56,44.99 68.04,45.47 77.88,45.47 v78.35,44.99
CONFIG2_5_6_N  (via drill 0.3)
  Top 0.305: IC16.2 95.71,43.73 95.33,44.1 v95.33,44.48 | IC15.35 86.15,43.73 86.49,44.07 v86.49,44.48
  Route2 0.305: v86.49,44.48 v95.33,44.48
CONFIG2_5_6_P  (via drill 0.3)
  Top 0.305: IC16.1 96.37,44.97 v96.35,44.99 | IC15.36 85.47,44.85 v85.6,44.98
  Route2 0.305: v85.6,44.98 85.95,45.34 96,45.34 v96.35,44.99
CONFIG2_6_7_N  (via drill 0.3)
  Top 0.305: IC16.35 104.2,43.73 104.58,44.1 v104.58,44.48 | IC17.2 113.71,43.73 113.33,44.1 v113.33,44.48
  Route2 0.305: v104.58,44.48 v113.33,44.48
CONFIG2_6_7_P  (via drill 0.3)
  Top 0.305: IC16.36 103.47,44.9 v103.56,44.99 | IC17.1 114.37,44.97 v114.35,44.99
  Route2 0.305: v103.56,44.99 104.04,45.47 113.88,45.47 v114.35,44.99
CONFIG2_7_8_N  (via drill 0.3)
  Top 0.305: IC17.35 122.2,43.73 122.58,44.1 v122.58,44.48 | IC18.2 131.71,43.73 131.33,44.1 v131.33,44.48
  Route2 0.305: v122.58,44.48 v131.33,44.48
CONFIG2_7_8_P  (via drill 0.3)
  Top 0.305: IC17.36 121.47,44.9 v121.56,44.99 | IC18.1 132.37,44.97 v132.35,44.99
  Route2 0.305: v121.56,44.99 122.04,45.47 131.88,45.47 v132.35,44.99
CONFIG2_8_N
  Top 0.305: IC18.35 140.5,43.73 140.84,44.07 TP5.TP
CONFIG2_8_P
  Top 0.305: IC18.36 140.04,44.23 141.15,45.34 TP4.TP
CONFIG2_N  (via drill 0.3)
  Top 0.305: IC11.2 5.71,43.73 5.33,44.1 v5.33,44.48 | v29.97,12.95 IC4.7
  Route15 0.305: v29.97,12.95 30.48,12.95 30.73,13.21 30.73,17.4 28.32,19.81 20.32,19.81 3.81,36.32 3.81,41.02 5.33,42.55 v5.33,44.48
CONFIG2_P  (via drill 0.3)
  Top 0.305: v29.97,11.68 IC4.6 | IC11.1 6.37,44.97 v6.35,44.99
  Route15 0.305: v29.97,11.68 30.86,11.68 31.5,12.32 31.5,17.65 28.57,20.57 20.57,20.57 4.57,36.58 4.57,40.77 6.35,42.55 v6.35,44.99
DVDD  (via drill 0.6)
  Top 0.406: C87.2 48.64,34.33 | C78.2 30.73,34.36
  other vias: 20.32,64.77 38.1,64.77 56.13,64.77 74.17,64.77 24.13,50.8 42.16,50.8 59.94,50.8 77.98,50.8 109.22,32.77 84.71,32.77 20.32,68.33 38.1,68.33 56.13,68.33 74.17,68.33 74.17,47.12 56.26,47.12 37.72,47.12 20.19,47.12 2.18,44.02 6.02,51.21 105.59,25.53 108.36,27.18 105.59,28.8 102.82,27.18 69.72,43.18 51.71,43.18 33.73,43.18 15.72,43.18 88.39,43.43 105.72,43.18 123.72,43.18 143.32,41.63 132.08,51.16 137.16,49.02 120.7,50.67 138.58,50.7 114.07,51.16 102.67,50.7 96.06,51.13 84.68,50.67 66.67,50.67 48.69,50.67 30.68,50.67 12.67,50.67 3.1,55.32 12.7,68.45 30.61,68.45 48.64,68.45 66.67,68.45 84.71,68.45 102.74,68.45 120.65,68.45 138.68,68.45 123.7,61.09 105.66,61.09 87.76,61.09 69.72,61.09 51.69,61.09 33.66,61.09 15.62,61.09 2.16,61.98 3.94,32.64 92.96,68.33 92.96,64.77 111,68.33 111,64.77 128.91,68.33 128.91,64.77 95.12,46.86 112.39,46.86 130.56,46.74
  pour Top (isolate 0.152): 0,70 145,70 145,33.75 112,33.75 110,31.75 110,26 108,24 66,24 56,34 22,34 14,26 12,26 8,30 0,30
  pour Route15 (isolate 0.305): 0,70 139.25,70 139.25,15.5 57.25,15.5 55,17.75 55,29.75 45.5,39.25 0,39.25
FAN_PWM
  Top 0.406: IC4.5 34.42,10.41 34.8,10.79 34.8,14.99 35.69,15.88 R12.1
GND  (via drill 0.3, 0.4, 0.6)
  Top 0.305: 8.42,59.48 7.67,60.23 IC6.5 4.35,60.23 C20.1 | IC6.8 7.67,58.73 8.42,59.48 | v11.67,57.73 IC6.27 C18.1 | v11.67,57.73 11.42,57.98 | C19.1 6.37,54.82 IC6.12 7.17,56.73 v8.17,57.73 8.42,57.98 | C21.1 12.17,64.56 IC6.38 12.17,61.73 v11.67,61.23 11.42,60.98 | C22.1 12.17,54.82 IC6.23 12.17,57.23 v11.67,57.73 | 26.42,59.48 25.67,60.23 IC7.5 22.35,60.23 C31.1 | IC7.8 25.67,58.73 26.42,59.48 | v29.67,57.73 IC7.27 C29.1 | v29.67,57.73 29.42,57.98 | C30.1 24.37,54.82 IC7.12 25.17,56.73 v26.17,57.73 26.42,57.98 | C32.1 30.17,64.56 IC7.38 30.17,61.73 v29.67,61.23 29.42,60.98 | C33.1 30.17,54.82 IC7.23 30.17,57.23 v29.67,57.73 | IC8.8 43.67,58.73 44.35,59.41 | 44.35,59.41 44.42,59.48 43.67,60.23 IC8.5 40.35,60.23 C40.1 | v47.67,57.73 IC8.27 C38.1 | v47.67,57.73 47.42,57.98 | C39.1 42.37,54.82 IC8.12 43.17,56.73 v44.17,57.73 44.42,57.98 | C41.1 48.17,64.56 IC8.38 48.17,61.73 v47.67,61.23 47.42,60.98 | C42.1 48.17,54.82 IC8.23 48.17,57.23 v47.67,57.73 | 62.42,59.48 61.67,60.23 IC9.5 58.35,60.23 C49.1 | IC9.8 61.67,58.73 62.42,59.48 | v65.67,57.73 IC9.27 C47.1 | v65.67,57.73 65.42,57.98 | C48.1 60.37,54.82 IC9.12 61.17,56.73 v62.17,57.73 62.42,57.98 | C50.1 66.17,64.56 IC9.38 66.17,61.73 v65.67,61.23 65.42,60.98 | C51.1 66.17,54.82 IC9.23 66.17,57.23 v65.67,57.73 | 80.42,59.48 79.67,60.23 IC10.5 76.35,60.23 C58.1 | IC10.8 79.67,58.73 80.42,59.48 | v83.67,57.73 IC10.27 C56.1 | v83.67,57.73 83.42,57.98 | C57.1 78.37,54.82 IC10.12 79.17,56.73 v80.17,57.73 80.42,57.98 | C59.1 84.17,64.56 IC10.38 84.17,61.73 v83.67,61.23 83.42,60.98 | C60.1 84.17,54.82 IC10.23 84.17,57.23 v83.67,57.73 | 8.42,41.48 7.67,42.23 IC11.5 4.35,42.23 C67.1
  Top 0.305: IC11.8 7.67,40.73 8.42,41.48 | v11.67,39.73 IC11.27 C65.1 | v11.67,39.73 11.42,39.98 | C66.1 6.37,36.82 IC11.12 7.17,38.73 v8.17,39.73 8.42,39.98 | C68.1 12.17,46.56 IC11.38 12.17,43.73 v11.67,43.23 11.42,42.98 | C69.1 12.17,36.82 IC11.23 12.17,39.23 v11.67,39.73 | 26.42,41.48 25.67,42.23 IC12.5 22.35,42.23 C76.1 | IC12.8 25.67,40.73 26.42,41.48 | v29.67,39.73 IC12.27 C74.1 | v29.67,39.73 29.42,39.98 | C75.1 24.37,36.82 IC12.12 25.17,38.73 v26.17,39.73 26.42,39.98 | C77.1 30.17,46.56 IC12.38 30.17,43.73 v29.67,43.23 29.42,42.98 | C78.1 30.17,36.82 IC12.23 30.17,39.23 v29.67,39.73 | 44.42,41.48 43.67,42.23 IC13.5 40.35,42.23 C85.1 | IC13.8 43.67,40.73 44.42,41.48 | v47.67,39.73 IC13.27 C83.1 | v47.67,39.73 47.42,39.98 | C84.1 42.37,36.82 IC13.12 43.17,38.73 v44.17,39.73 44.42,39.98 | C86.1 48.17,46.56 IC13.38 48.17,43.73 v47.67,43.23 47.42,42.98 | C87.1 48.17,36.82 IC13.23 48.17,39.23 v47.67,39.73 | 62.42,41.48 61.67,42.23 IC14.5 58.35,42.23 C94.1 | IC14.8 61.67,40.73 62.42,41.48 | 66.04,39.73 v65.67,39.73 65.42,39.98 | 66.04,39.73 IC14.27 C92.1 | C93.1 60.37,36.82 IC14.12 61.17,38.73 v62.17,39.73 62.42,39.98 | C95.1 66.17,46.56 IC14.38 66.17,43.73 v65.67,43.23 65.42,42.98 | C96.1 66.17,36.82 IC14.23 66.17,39.6 66.04,39.73 | 80.42,41.48 79.67,42.23 IC15.5 76.35,42.23 C103.1 | IC15.8 79.67,40.73 80.42,41.48 | 83.95,39.73 v83.67,39.73 83.42,39.98 | 83.95,39.73 IC15.27 C101.1 | C102.1 78.37,36.82 IC15.12 79.17,38.73 v80.17,39.73 80.42,39.98 | C104.1 84.17,46.56 IC15.38 84.17,43.73 v83.67,43.23 83.42,42.98 | C105.1 84.17,36.82 IC15.23 84.17,39.51 83.95,39.73 | v44.17,59.48 44.28,59.48 44.35,59.41
  Top 0.305: 62.42,59.48 v62.17,59.48 | 80.42,59.48 v80.17,59.48 | 26.42,59.48 v26.17,59.48 | 8.42,59.48 v8.17,59.48 | 8.42,41.48 v8.17,41.48 | 26.42,41.48 v26.17,41.48 | 44.42,41.48 v44.17,41.48 | 62.42,41.48 v62.17,41.48 | 80.42,41.48 v80.17,41.48 | 98.42,41.48 97.67,42.23 IC16.5 94.35,42.23 C111.1 | IC16.8 97.67,40.73 98.42,41.48 | 102.04,39.73 v101.67,39.73 101.42,39.98 | 102.04,39.73 IC16.27 C109.1 | C110.1 96.37,36.82 IC16.12 97.17,38.73 v98.17,39.73 98.42,39.98 | C112.1 102.17,46.56 IC16.38 102.17,43.73 v101.67,43.23 101.42,42.98 | C113.1 102.17,36.82 IC16.23 102.17,39.6 102.04,39.73 | 98.42,41.48 v98.17,41.48 | 116.42,41.48 115.67,42.23 IC17.5 112.35,42.23 C120.1 | IC17.8 115.67,40.73 116.42,41.48 | 120.04,39.73 v119.67,39.73 119.42,39.98 | 120.04,39.73 IC17.27 C118.1 | C119.1 114.37,36.82 IC17.12 115.17,38.73 v116.17,39.73 116.42,39.98 | C121.1 120.17,46.56 IC17.38 120.17,43.73 v119.67,43.23 119.42,42.98 | C122.1 120.17,36.82 IC17.23 120.17,39.6 120.04,39.73 | 116.42,41.48 v116.17,41.48 | 134.42,41.48 133.67,42.23 IC18.5 130.35,42.23 C129.1 | IC18.8 133.67,40.73 134.42,41.48 | 138.04,39.73 v137.67,39.73 137.42,39.98 | 138.04,39.73 IC18.27 C127.1 | C128.1 132.37,36.82 IC18.12 133.17,38.73 v134.17,39.73 134.42,39.98 | C130.1 138.17,46.56 IC18.38 138.17,43.73 v137.67,43.23 137.42,42.98 | C131.1 138.17,36.82 IC18.23 138.17,39.6 138.04,39.73 | 134.42,41.48 v134.17,41.48 | IC19.8 97.67,58.73 98.35,59.41 | 98.35,59.41 98.42,59.48 97.67,60.23 IC19.5 94.35,60.23 C138.1 | v101.67,57.73 IC19.27 C136.1 | v101.67,57.73 101.42,57.98 | C137.1 96.37,54.82 IC19.12 97.17,56.73 v98.17,57.73 98.42,57.98 | C139.1 102.17,64.56 IC19.38 102.17,61.73 v101.67,61.23 101.42,60.98
  Top 0.305: C140.1 102.17,54.82 IC19.23 102.17,57.23 v101.67,57.73 | v98.17,59.48 98.28,59.48 98.35,59.41 | IC20.8 115.67,58.73 116.35,59.41 | 116.35,59.41 116.42,59.48 115.67,60.23 IC20.5 112.35,60.23 C147.1 | v119.67,57.73 IC20.27 C145.1 | v119.67,57.73 119.42,57.98 | C146.1 114.37,54.82 IC20.12 115.17,56.73 v116.17,57.73 116.42,57.98 | C148.1 120.17,64.56 IC20.38 120.17,61.73 v119.67,61.23 119.42,60.98 | C149.1 120.17,54.82 IC20.23 120.17,57.23 v119.67,57.73 | v116.17,59.48 116.28,59.48 116.35,59.41 | IC21.8 133.67,58.73 134.35,59.41 | 134.35,59.41 134.42,59.48 133.67,60.23 IC21.5 130.35,60.23 C156.1 | v137.67,57.73 IC21.27 C154.1 | v137.67,57.73 137.42,57.98 | C155.1 132.37,54.82 IC21.12 133.17,56.73 v134.17,57.73 134.42,57.98 | C157.1 138.17,64.56 IC21.38 138.17,61.73 v137.67,61.23 137.42,60.98 | C158.1 138.17,54.82 IC21.23 138.17,57.23 v137.67,57.73 | v134.17,59.48 134.28,59.48 134.35,59.41
  Top 0.406: C61.1 v88,52.39 v88.01,52.4 | Q2.2 36.78,13.83 R13.2 | v77.34,32.51 C7.2 | v93.09,32.51 C8.2 | 140.34,22.1 v142.24,22.1 | 140.59,30.61 v142.24,30.61 | v129.79,30.61 131.19,30.61 | 129.92,22.1 131.83,22.1 | v132.59,19.43 132.59,21.46 | v139.45,19.43 139.45,21.46 | R14.2 72.33,47.56 v72.26,47.5
  Top 0.61: C24.1 16.02,66.99 v16.03,66.98 | C26.1 v9.65,68.33 | C25.2 v1.04,58.67 | C23.1 16.02,52.39 v16.03,52.4 | C35.1 34.02,66.99 v34.03,66.98 | C27.1 v27.65,68.33 | C28.2 v18.89,58.67 | C34.1 34.02,52.39 v34.03,52.4 | C44.1 52.02,66.99 v52.03,66.98 | C36.1 v45.65,68.33 | v36.89,58.67 C37.2 | C43.1 52.02,52.39 v52.03,52.4 | C53.1 70.02,66.99 v70.03,66.98 | C45.1 v63.65,68.33 | v54.89,58.67 C46.2 | C52.1 70.02,52.39 v70.03,52.4 | C62.1 88.02,66.99 v88.03,66.98 | C54.1 v81.65,68.33 | v72.89,58.67 C55.2 | C71.1 16.02,48.99 v16.03,48.98 | C63.1 v9.65,50.33 | C64.2 v1.02,40.67 | C70.1 16.02,34.39 v16.03,34.4 | C80.1 34.02,48.99 v34.03,48.98 | C72.1 v27.65,50.33 | C73.2 v18.89,40.67 | C89.1 52.02,48.99 v52.03,48.98 | C81.1 v45.65,50.33 | v36.89,40.67 C82.2 | C98.1 70.02,48.99 v70.03,48.98 | C90.1 v63.65,50.33 | v54.89,40.67 C91.2 | C97.1 70.02,34.39 v70.03,34.4 | C107.1 88.02,48.99 v88.03,48.98 | C99.1 v81.65,50.33 | v72.89,40.67 C100.2 | C106.1 88.02,34.39 v88.03,34.4 | C115.1 106.02,48.99 v106.03,48.98 | C12.1 v99.65,50.33 | v90.89,40.67 C108.2 | C114.1 106.02,34.39 v106.03,34.4 | C124.1 124.02,48.99 v124.03,48.98 | C116.1 v117.65,50.33 | v108.89,40.67 C117.2 | C123.1 124.02,34.39 v124.03,34.4 | C133.1 142.02,48.99 v142.03,48.98 | C125.1 v135.65,50.33 | v126.89,40.67 C126.2 | C132.1 142.02,34.39 v142.03,34.4 | C142.1 106.02,66.99 v106.03,66.98 | C134.1 v99.65,68.33 | v90.89,58.67 C135.2 | C141.1 106.02,52.39 v106.03,52.4 | C151.1 124.02,66.99 v124.03,66.98 | C143.1 v117.65,68.33 | v108.89,58.67 C144.2 | C150.1 124.02,52.39 v124.03,52.4 | C160.1 142.02,66.99 v142.03,66.98 | C152.1 v135.65,68.33 | v126.89,58.67 C153.2 | C159.1 142.02,52.39 v142.03,52.4 | C79.1 v32.48,33.03
  Top 0.61: v50.48,32.98 C88.1
  Top 0.813: C6.2 68.51,30.92 68.16,30.57 IC1.14
  other vias: 9.92,59.48 9.92,61.23 8.17,61.23 11.67,59.48 9.92,57.73 10.79,58.6 9.04,58.6 9.04,60.35 10.79,60.35 27.92,59.48 27.92,61.23 26.17,61.23 29.67,59.48 27.92,57.73 28.8,58.6 27.05,58.6 27.05,60.35 28.8,60.35 45.92,59.48 45.92,61.23 44.17,61.23 47.67,59.48 45.92,57.73 46.8,58.6 45.05,58.6 45.05,60.35 46.8,60.35 63.92,59.48 63.92,61.23 62.17,61.23 65.67,59.48 63.92,57.73 64.8,58.6 63.05,58.6 63.05,60.35 64.8,60.35 81.92,59.48 81.92,61.23 80.17,61.23 83.67,59.48 81.92,57.73 82.8,58.6 81.05,58.6 81.05,60.35 82.8,60.35 9.92,41.48 9.92,43.23 8.17,43.23 11.67,41.48 9.92,39.73 10.79,40.6 9.04,40.6 9.04,42.35 10.79,42.35 27.92,41.48 27.92,43.23 26.17,43.23 29.67,41.48 27.92,39.73 28.8,40.6 27.05,40.6 27.05,42.35 28.8,42.35 45.92,41.48 45.92,43.23 44.17,43.23 47.67,41.48 45.92,39.73 46.8,40.6 45.05,40.6 45.05,42.35 46.8,42.35 63.92,41.48 63.92,43.23 62.17,43.23 65.67,41.48 63.92,39.73 64.8,40.6 63.05,40.6 63.05,42.35 64.8,42.35 81.92,41.48 81.92,43.23 80.17,43.23 83.67,41.48 81.92,39.73 82.8,40.6 81.05,40.6 81.05,42.35 82.8,42.35 139.95,6.86 138.94,6.86 140.97,6.86 139.95,3.17 138.94,3.17 140.97,3.17 41.56,30.74 140.94,17.35 139.45,15.47 140.94,15.47 138.35,12.75 140.67,9.96 114.12,25.35 118.57,25.35 118.57,29.01 114.12,29.03 111.25,27.2 121.36,27.23 135.89,12.7 136.02,15.44 43.82,21.5 52.7,12.7 57.78,12.7 62.87,12.7 67.94,12.7 73.03,12.7 78.11,12.7 88.27,12.7 93.34,12.7 98.42,12.7 98.42,20.32 93.34,20.32 88.27,20.32 78.11,20.32 73.03,20.32 67.94,20.32 62.87,20.32 57.78,20.32 118.75,20.32 123.83,20.32 61.26,2.51 77.22,2.51 93.09,2.51 100.97,2.54 106.05,2.54 111.12,2.54 116.2,2.54 118.75,5.33 123.83,5.33 123.83,7.62 123.83,9.91 126.36,9.91 128.91,9.91 128.91,7.62 126.36,7.62 126.36,5.33 121.28,5.33 121.28,7.62 121.28,9.91 118.75,9.91 118.75,7.62 118.75,12.45 128.91,15.24 129.74,2.57 23.88,22.61 99.92,41.48 99.92,43.23 98.17,43.23 101.67,41.48 99.92,39.73 100.8,40.6 99.05,40.6 99.05,42.35 100.8,42.35 117.92,41.48 117.92,43.23 116.17,43.23 119.67,41.48 117.92,39.73 118.8,40.6 117.05,40.6 117.05,42.35 118.8,42.35 135.92,41.48 135.92,43.23 134.17,43.23 137.67,41.48 135.92,39.73 136.79,40.6 135.04,40.6 135.04,42.35 136.79,42.35 99.92,59.48 99.92,61.23 98.17,61.23 101.67,59.48 99.92,57.73 100.8,58.6 99.05,58.6 99.05,60.35 100.8,60.35 117.92,59.48 117.92,61.23 116.17,61.23 119.67,59.48 117.92,57.73 118.8,58.6 117.05,58.6 117.05,60.35 118.8,60.35 135.92,59.48 135.92,61.23 134.17,61.23 137.67,59.48 135.92,57.73 136.79,58.6 135.04,58.6 135.04,60.35 136.79,60.35 35.81,9.65 28.45,3.43 27.3,14.35 11.18,3.17 10.92,20.83 14.99,20.83 12.9,17.83 14.86,29.34 34.42,22.73 24.64,32.77 34.92,31.88 48.64,26.8 20.57,3.68 129.79,26.42 142.24,26.42 136.02,19.43 129.79,22.1 68.07,26.54 71.37,26.54 74.3,29.21 87.25,26.54 90.17,29.21 55.5,26.54 58.17,29.34
  pour Bottom (isolate 0.406): 0,0 145,0 145,70 0,70
  pour Top (isolate 0.305): 0,0 145,0 145,33 112.5,33 110.75,31.25 110.75,25.75 108.25,23.25 65.5,23.25 55.5,33.25 22.5,33.25 14.5,25.25 11.75,25.25 7.5,29.25 0,29.25
  pour Route2 (isolate 0.406): 0,0 0,70 145,70 145,0
ICSPCLK
  Top 0.406: IC4.15 20.7,11.68 15.61,16.78 X2.5
ICSPDAT
  Top 0.406: IC4.16 20.7,10.41 15.62,15.49 2.67,15.49 2.16,16 2.16,18.8 2.67,19.3 4.59,19.3 X2.4
LED
  Top 0.406: IC4.2 26.92,6.6 26.42,6.1 26.42,3.94 24.58,2.1 R9.2
N$41
  Top 0.406: C16.2 24.89,3.68 25.53,4.32 25.53,8.26 24.64,9.14 IC4.17
N$42
  Top 0.406: IC1.17 50.68,29.22 50.29,28.83 50.29,26.54 49.02,25.27 R2.1
N$43
  Top 0.406: R2.2 49.02,21.46 50.29,20.19 50.29,6.71 R3.1
N$44
  Top 0.813: IC3.2 134.36,15.36 133.99,14.99 133.99,13.43 D1.C
  Top 1.016: L1.1 124.94,12.76 124.97,12.73
  Top 1.27: 124.97,12.73 D1.C
N$45
  Top 0.406: IC2.5 39.64,25.15 Q1.3
N$46
  Top 0.406: 35.47,7.28 D2.A 35.38,8.46 35.56,8.64 37.59,8.64 37.73,8.78 Q2.3
  Top 0.61: X3.1 35.47,7.28
N$47
  Top 0.406: IC5.13 24.89,29.21 23.62,27.94 23.62,25.91 23.11,25.4 IC5.5 19.75,25.4 R8.1
N$48
  Top 0.406: IC5.4 IC5.3 IC5.2
N$49
  Top 0.406: R12.2 R13.1 38.68,13.83 Q2.1
N$51
  Top 0.406: IC5.6 19.75,24.13 R8.2 C17.2
N$55
  Top 0.406: X3.3 42.71,2.77 R7.2 R4.2
N$56
  Top 0.406: R9.1 LED1.A
NTC  (via drill 0.3)
  Top 0.305: RT1.1 R14.1 75.56,50.04 75.82,49.78 v75.82,48.01
  Top 0.406: IC4.14 20.7,12.95 17.53,16.13 v17.53,34.92
  Route2 0.305: v75.82,35.31 65.91,35.31 64.64,34.04 62.36,34.04 61.09,35.31 47.88,35.31 46.61,34.04 44.32,34.04 43.05,35.31 29.97,35.31 28.57,33.91 26.42,33.91 25.4,34.92 v17.53,34.92
  Route15 0.305: v75.82,35.31 v75.82,48.01
OSC_EN
  Top 0.406: IC4.3 29.84,7.87 28.83,8.89 28.83,18.92 32.51,22.61 32.51,29.21 33.03,29.73 Q1.1
REPORT_CLK  (via drill 0.3)
  Top 0.305: v29.97,16.76 IC4.10
  Top 0.406: IC5.1 21.82,31.73 v21.84,31.75
  Route2 0.406: v21.84,31.75 26.54,31.75 29.97,28.32 v29.97,16.76
REPORT_DATA  (via drill 0.3)
  Top 0.406: IC4.12 v24.38,15.49 | v25.91,25.4 IC5.10
  Route2 0.406: v25.91,25.4 25.91,17.02 v24.38,15.49
REPORT_N  (via drill 0.3)
  Top 0.305: v8.67,54.23 IC6.16 | v26.67,54.23 IC7.16 | v44.67,54.23 IC8.16 | v62.67,54.23 IC9.16 | v80.67,54.23 IC10.16 | v8.67,36.23 IC11.16 | v26.67,36.23 IC12.16 | v44.67,36.23 IC13.16 | v62.67,36.23 IC14.16 | v80.67,36.23 IC15.16 | 30.16,27.94 R6.2 | v98.67,36.23 IC16.16 | v116.67,36.23 IC17.16 | v134.67,36.23 IC18.16 | v98.67,54.23 IC19.16 | v116.67,54.23 IC20.16 | v134.67,54.23 IC21.16
  Top 0.406: 30.16,27.94 IC5.12 v25.91,27.94 25.27,27.94 24.64,27.3 24.64,25.02 25.53,24.13 IC5.9 IC5.8
  Route2 0.305: 9.47,53.42 4.19,48.13 4.19,38.61 6.57,36.23 v8.67,36.23 9.34,35.56 9.65,35.56 11.3,37.21 25.69,37.21 v26.67,36.23 27.21,35.69 27.81,35.69 29.34,37.21 43.69,37.21 v44.67,36.23 45.21,35.69 45.85,35.69 47.37,37.21 61.69,37.21 v62.67,36.23 62.7,36.23 63.25,35.69 63.75,35.69 65.28,37.21 79.69,37.21 79.69,37.15 80.67,36.17 | 9.47,53.42 11.18,55.12 25.78,55.12 v26.67,54.23 27.3,53.59 27.94,53.59 29.46,55.12 43.78,55.12 v44.67,54.23 45.3,53.59 45.72,53.59 47.24,55.12 61.78,55.12 v62.67,54.23 63.3,53.59 63.75,53.59 65.28,55.12 79.78,55.12 79.78,55.09 80.65,54.23 | v8.67,54.23 9.47,53.42 | 98.67,36.2 97.66,37.21 83.31,37.21 81.79,35.69 81.15,35.69 80.67,36.17 | v116.68,36.23 115.7,37.21 101.35,37.21 99.82,35.69 99.19,35.69 98.67,36.2 | v134.67,36.23 133.69,37.21 119.25,37.21 117.73,35.69 117.22,35.69 v116.68,36.23 | v116.68,36.23 v116.67,36.23 | 98.67,36.2 v98.67,36.23 | 80.67,36.17 v80.67,36.23 | 80.65,54.23 81.15,53.72 82.04,53.72 83.44,55.12 97.79,55.12 v98.68,54.23 | v98.68,54.23 99.19,53.72 99.82,53.72 101.22,55.12 115.8,55.12 116.69,54.23 | v134.67,54.23 133.78,55.12 119.38,55.12 117.88,53.62 117.3,53.62 116.69,54.23 | 116.69,54.23 v116.67,54.23 | v98.67,54.23 v98.68,54.23 | 80.65,54.23 v80.67,54.23
  Route15 0.305: v25.91,27.94 25.91,35.47 v26.67,36.23
REPORT_P  (via drill 0.3)
  Top 0.305: IC6.17 9.17,54.73 v9.42,54.48 | IC7.17 27.17,54.73 v27.42,54.48 | IC8.17 45.17,54.73 v45.42,54.48 | IC9.17 63.17,54.73 v63.42,54.48 | IC10.17 81.17,54.73 v81.42,54.48 | IC11.17 9.17,36.73 v9.42,36.48 | IC12.17 27.17,36.73 v27.42,36.48 | IC13.17 45.17,36.73 v45.42,36.48 | IC14.17 63.17,36.73 v63.42,36.48 | IC17.17 117.17,36.73 v117.42,36.48 | IC18.17 135.17,36.73 v135.42,36.48 | IC19.17 99.17,54.73 v99.42,54.48 | IC20.17 117.17,54.73 v117.42,54.48 | IC21.17 135.17,54.73 v135.42,54.48 | IC15.17 81.17,36.73 v81.42,36.48 | IC16.17 99.17,36.73 v99.42,36.48
  Top 0.406: R5.2 30.16,26.67 IC5.11 v25.91,26.67
  Route2 0.305: 27.43,55.88 10.82,55.88 v9.42,54.48 8.91,54.99 8.38,54.99 4.45,51.05 4.45,49.4 3.56,48.51 3.56,38.35 6.73,35.18 v8.64,35.18 | 27.43,55.88 45.44,55.88 | 45.44,55.88 63.45,55.88 | v27.42,54.48 27.43,54.49 27.43,55.88 | v45.42,54.48 45.42,55.86 45.44,55.88 | v63.42,54.48 63.42,55.85 63.45,55.88 | 27.43,37.97 45.41,37.97 | 45.41,37.97 63.42,37.97 | v27.42,36.48 27.42,37.96 27.43,37.97 | v45.42,36.48 45.42,37.97 45.41,37.97 | v63.42,36.48 63.42,37.97 | v9.42,36.48 10.91,37.97 27.43,37.97 | 117.42,37.98 v117.42,36.48 | 81.42,37.98 v81.42,36.48 | 81.42,37.98 IC16.17 | IC16.17 99.42,37.98 v99.42,36.48 | 81.42,37.98 63.89,37.98 63.88,37.97 63.42,37.97 | 63.45,55.88 81.42,55.88 | 117.42,55.88 v117.42,54.48 | 99.42,55.88 v99.42,54.48 | 99.42,55.88 117.42,55.88 | 81.42,55.88 v81.42,54.48 | 81.42,55.88 99.42,55.88 | 117.42,55.88 134.02,55.88 v135.42,54.48 136.4,54.48 139.45,51.44 139.45,38.99 138.44,37.98 135.42,37.98 | 135.42,37.98 v135.42,36.48 | 117.42,37.98 135.42,37.98 | IC16.17 IC17.17 117.42,37.98
  Route15 0.305: v9.42,36.48 9.4,36.46 9.4,35.43 9.14,35.18 v8.64,35.18 8.64,33.53 15.49,26.67 v25.91,26.67
SCL
  Top 0.305: TP7.TP R11.2 24.13,18.41 24.38,18.16 24.38,17.14 24,16.76 IC4.11
SDA
  Top 0.305: R10.2 TP8.TP 26.42,20.45 26.67,20.19 26.67,15.88 25.02,14.22 IC4.13
SENSE_VCC_D1  (via drill 0.3)
  Top 0.406: 6.01,30.86 R1.1 4.74,30.82 v4.7,30.86 | TP1.TP 52.64,1.84 v53.72,0.76
  Route2 0.406: v84.02,12.7 84.02,29.2 IC1.11
  Route15 0.406: v84.02,12.7 84.02,2.23 82.55,0.76 v53.72,0.76 1.4,0.76 0.76,1.4 0.76,26.97 4.66,30.86 v4.7,30.86
USB_DM
  Top 0.406: IC4.18 20.83,7.87 20.32,8.38 20.32,9.53 16.38,13.46 11.94,13.46 10.38,11.91 X4.2
USB_DP  (via drill 0.3)
  Top 0.406: v24.38,6.6 IC4.19 20.7,6.6 19.43,7.87 19.43,9.14 16,12.57 12.32,12.57 11.18,11.44 X4.3
VDD_PLL1
  Top 0.305: IC6.6 IC6.7 4.68,59.23 C25.1 L2.2
VDD_PLL2
  Top 0.305: IC7.6 IC7.7 22.68,59.23 C28.1 L3.2
VDD_PLL3
  Top 0.305: IC8.6 IC8.7 40.68,59.23 C37.1 L4.2
VDD_PLL4
  Top 0.305: IC9.6 IC9.7 58.68,59.23 C46.1 L5.2
VDD_PLL5
  Top 0.305: IC10.6 IC10.7 76.68,59.23 C55.1 L6.2
VDD_PLL6
  Top 0.305: IC11.6 IC11.7 4.68,41.23 C64.1 L7.2
VDD_PLL7
  Top 0.305: IC12.6 IC12.7 22.68,41.23 C73.1 L8.2
VDD_PLL8
  Top 0.305: IC13.6 IC13.7 40.68,41.23 C82.1 L9.2
VDD_PLL9
  Top 0.305: IC14.6 IC14.7 58.68,41.23 C91.1 L10.2
VDD_PLL10
  Top 0.305: IC15.6 IC15.7 76.68,41.23 C100.1 L11.2
VDD_PLL11
  Top 0.305: IC16.6 IC16.7 94.68,41.23 C108.1 L12.2
VDD_PLL12
  Top 0.305: IC17.6 IC17.7 112.68,41.23 C117.1 L13.2
VDD_PLL13
  Top 0.305: IC18.6 IC18.7 130.68,41.23 C126.1 L14.2
VDD_PLL14
  Top 0.305: IC19.6 IC19.7 94.68,59.23 C135.1 L15.2
VDD_PLL15
  Top 0.305: IC20.6 IC20.7 112.68,59.23 C144.1 L16.2
VDD_PLL16
  Top 0.305: IC21.6 IC21.7 130.68,59.23 C153.1 L17.2

## Text on the board
tPlace: 1 | ISP | Avalon-Gen2 Hasher v1.1 | Voltage | Testpoint